# EAGLE schematic RFMDisplay (EAGLE 6.5.0)
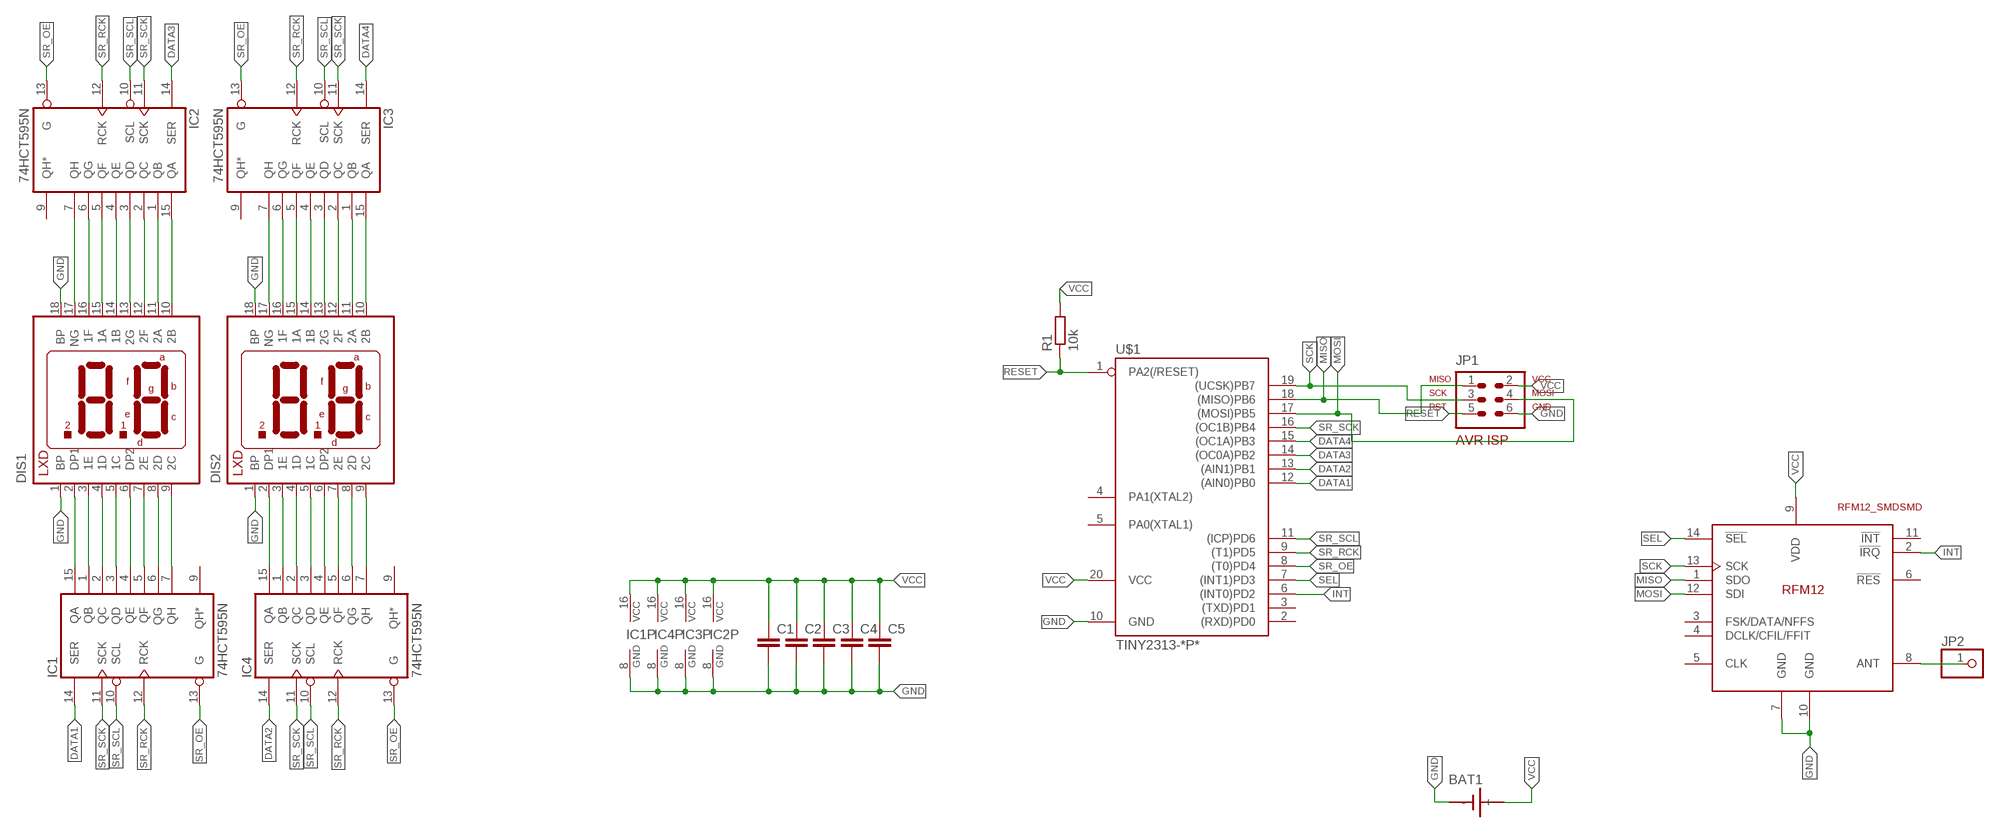
[diagram p0: schematic, sheet 1]

## Parts
BAT1  SN2032  [SN2032]
C1  C-EUC0805  [C0805]
C2  C-EUC0805  [C0805]
C3  C-EUC0805  [C0805]
C4  C-EUC0805  [C0805]
C5  C-EUC0805  [C0805]
DIS1  29DIP  [29-D]
DIS2  29DIP  [29-D]
IC1  74HCT595N  [DIL16]
IC2  74HCT595N  [DIL16]
IC3  74HCT595N  [DIL16]
IC4  74HCT595N  [DIL16]
JP1  AVR-ISP-6VERT  [AVR-ISP-6]
JP2  PINHD-1X1  [1X01]
R1  10k  R-EU_R1206  [R1206]
U$1  TINY2313-*P*  [DIL20]
U$2  RFM12_SMDSMD  [RFM12]

## Nets
DATA1: IC1.14(SER) U$1.12((AIN0)PB0)
DATA2: IC4.14(SER) U$1.13((AIN1)PB1)
DATA3: IC2.14(SER) U$1.14((OC0A)PB2)
DATA4: IC3.14(SER) U$1.15((OC1A)PB3)
GND: BAT1.- C1.2 C2.2 C3.2 C4.2 C5.2 DIS1.1(BP) DIS1.18(BP) DIS2.1(BP) DIS2.18(BP) IC1.8(GND) IC2.8(GND) IC3.8(GND) IC4.8(GND) JP1.6 U$1.10(GND) U$2.7(GND) U$2.10(GND)
INT: U$1.6((INT0)PD2) U$2.2(!IRQ)
MISO: JP1.1 U$1.18((MISO)PB6) U$2.1(SDO)
MOSI: JP1.4 U$1.17((MOSI)PB5) U$2.12(SDI)
N$1: DIS1.2(DP1) IC1.15(QA)
N$2: DIS1.3(1E) IC1.1(QB)
N$3: DIS1.4(1D) IC1.2(QC)
N$4: DIS1.5(1C) IC1.3(QD)
N$5: DIS1.6(DP2) IC1.4(QE)
N$6: DIS1.7(2E) IC1.5(QF)
N$7: DIS1.8(2D) IC1.6(QG)
N$8: DIS1.9(2C) IC1.7(QH)
N$9: DIS1.10(2B) IC2.15(QA)
N$10: DIS1.11(2A) IC2.1(QB)
N$11: DIS1.12(2F) IC2.2(QC)
N$12: DIS1.13(2G) IC2.3(QD)
N$13: DIS1.14(1B) IC2.4(QE)
N$14: DIS1.15(1A) IC2.5(QF)
N$15: DIS1.16(1F) IC2.6(QG)
N$16: DIS1.17(NG) IC2.7(QH)
N$17: DIS2.10(2B) IC3.15(QA)
N$18: DIS2.11(2A) IC3.1(QB)
N$19: DIS2.12(2F) IC3.2(QC)
N$20: DIS2.13(2G) IC3.3(QD)
N$21: DIS2.14(1B) IC3.4(QE)
N$22: DIS2.15(1A) IC3.5(QF)
N$23: DIS2.16(1F) IC3.6(QG)
N$24: DIS2.17(NG) IC3.7(QH)
N$25: DIS2.2(DP1) IC4.15(QA)
N$26: DIS2.3(1E) IC4.1(QB)
N$27: DIS2.4(1D) IC4.2(QC)
N$28: DIS2.5(1C) IC4.3(QD)
N$29: DIS2.6(DP2) IC4.4(QE)
N$30: DIS2.7(2E) IC4.5(QF)
N$31: DIS2.8(2D) IC4.6(QG)
N$32: DIS2.9(2C) IC4.7(QH)
N$33: JP2.1 U$2.8(ANT)
RESET: JP1.5 R1.1 U$1.1(PA2(/RESET))
SCK: JP1.3 U$1.19((UCSK)PB7) U$2.13(SCK)
SEL: U$1.7((INT1)PD3) U$2.14(!SEL)
SR_OE: IC1.13(G) IC2.13(G) IC3.13(G) IC4.13(G) U$1.8((T0)PD4)
SR_RCK: IC1.12(RCK) IC2.12(RCK) IC3.12(RCK) IC4.12(RCK) U$1.9((T1)PD5)
SR_SCK: IC1.11(SCK) IC2.11(SCK) IC3.11(SCK) IC4.11(SCK) U$1.16((OC1B)PB4)
SR_SCL: IC1.10(SCL) IC2.10(SCL) IC3.10(SCL) IC4.10(SCL) U$1.11((ICP)PD6)
VCC: BAT1.+ C1.1 C2.1 C3.1 C4.1 C5.1 IC1.16(VCC) IC2.16(VCC) IC3.16(VCC) IC4.16(VCC) JP1.2 R1.2 U$1.20(VCC) U$2.9(VDD)
Unconnected: IC1.9(QH*) IC2.9(QH*) IC3.9(QH*) IC4.9(QH*) U$1.2((RXD)PD0) U$1.3((TXD)PD1) U$1.4(PA1(XTAL2)) U$1.5(PA0(XTAL1)) U$2.3(FSK/DATA/NFFS) U$2.4(DCLK/CFIL/FFIT) U$2.5(CLK) U$2.6(!RES) U$2.11(!INT)

## Library data of the parts
BAT1 = sn2032:SN2032: LI BATTERY
C1-C5 = rcl:C-EU: CAPACITOR, European symbol
DIS1 DIS2 = DE112:29: 2 Numerical Digit, .50" (12.70) Direct Drive Display Additional Descriptors: none
IC1-IC4 = 74xx-eu:74*595: 8-bit SHIFT REGISTER, output latch
JP1 = avr-7:AVR-ISP-6: AVR ISP-6 Serial Programming Header
JP2 = pinhead:PINHD-1X1: PIN HEADER
R1 = rcl:R-EU_: RESISTOR, European symbol
U$1 = avr-7:TINY2313*: Atmel Tiny2313 2K Flash, 128 bytes EEPROM, 128 bytes RAM
U$2 = rfm_12:RFM12_SMD: RFM12 is a low costing ISM band transceiver module implemented with unique PLL. It works signal ranges from 315/433/868/915MHZ bands, comply with FCC, ETSI regulation. The SPI interface is used to communicate with microcontroller for parameter setting.